# Altium schematic sheet FPGA_SUP_CFG.SchDoc: Phaser
size 420 x 297 mm; EDA_Number: ARTIQ; Projet: ARTIQ/SINARA; Author: G.Kasprowicz; CompanyName: WUT ISE; DrawnBy: G.Kasprowicz; Organization: WUT ISE; Address1: PW ISE; Address2: Nowowiejska 15/19 00-665 Warsaw; Address3: gkasprow@gmail.com; DocumentNumber: 12; Revision: 2; SheetNumber: 12; SheetTotal: 18; ModifiedBy: -; CheckedDate: -; Title2: FPGA SUP & caps + config; DivGrp: WUT ISE; Designer: G.Kasprowicz; ModifiedDate: -; ProjectName: Sensor Box
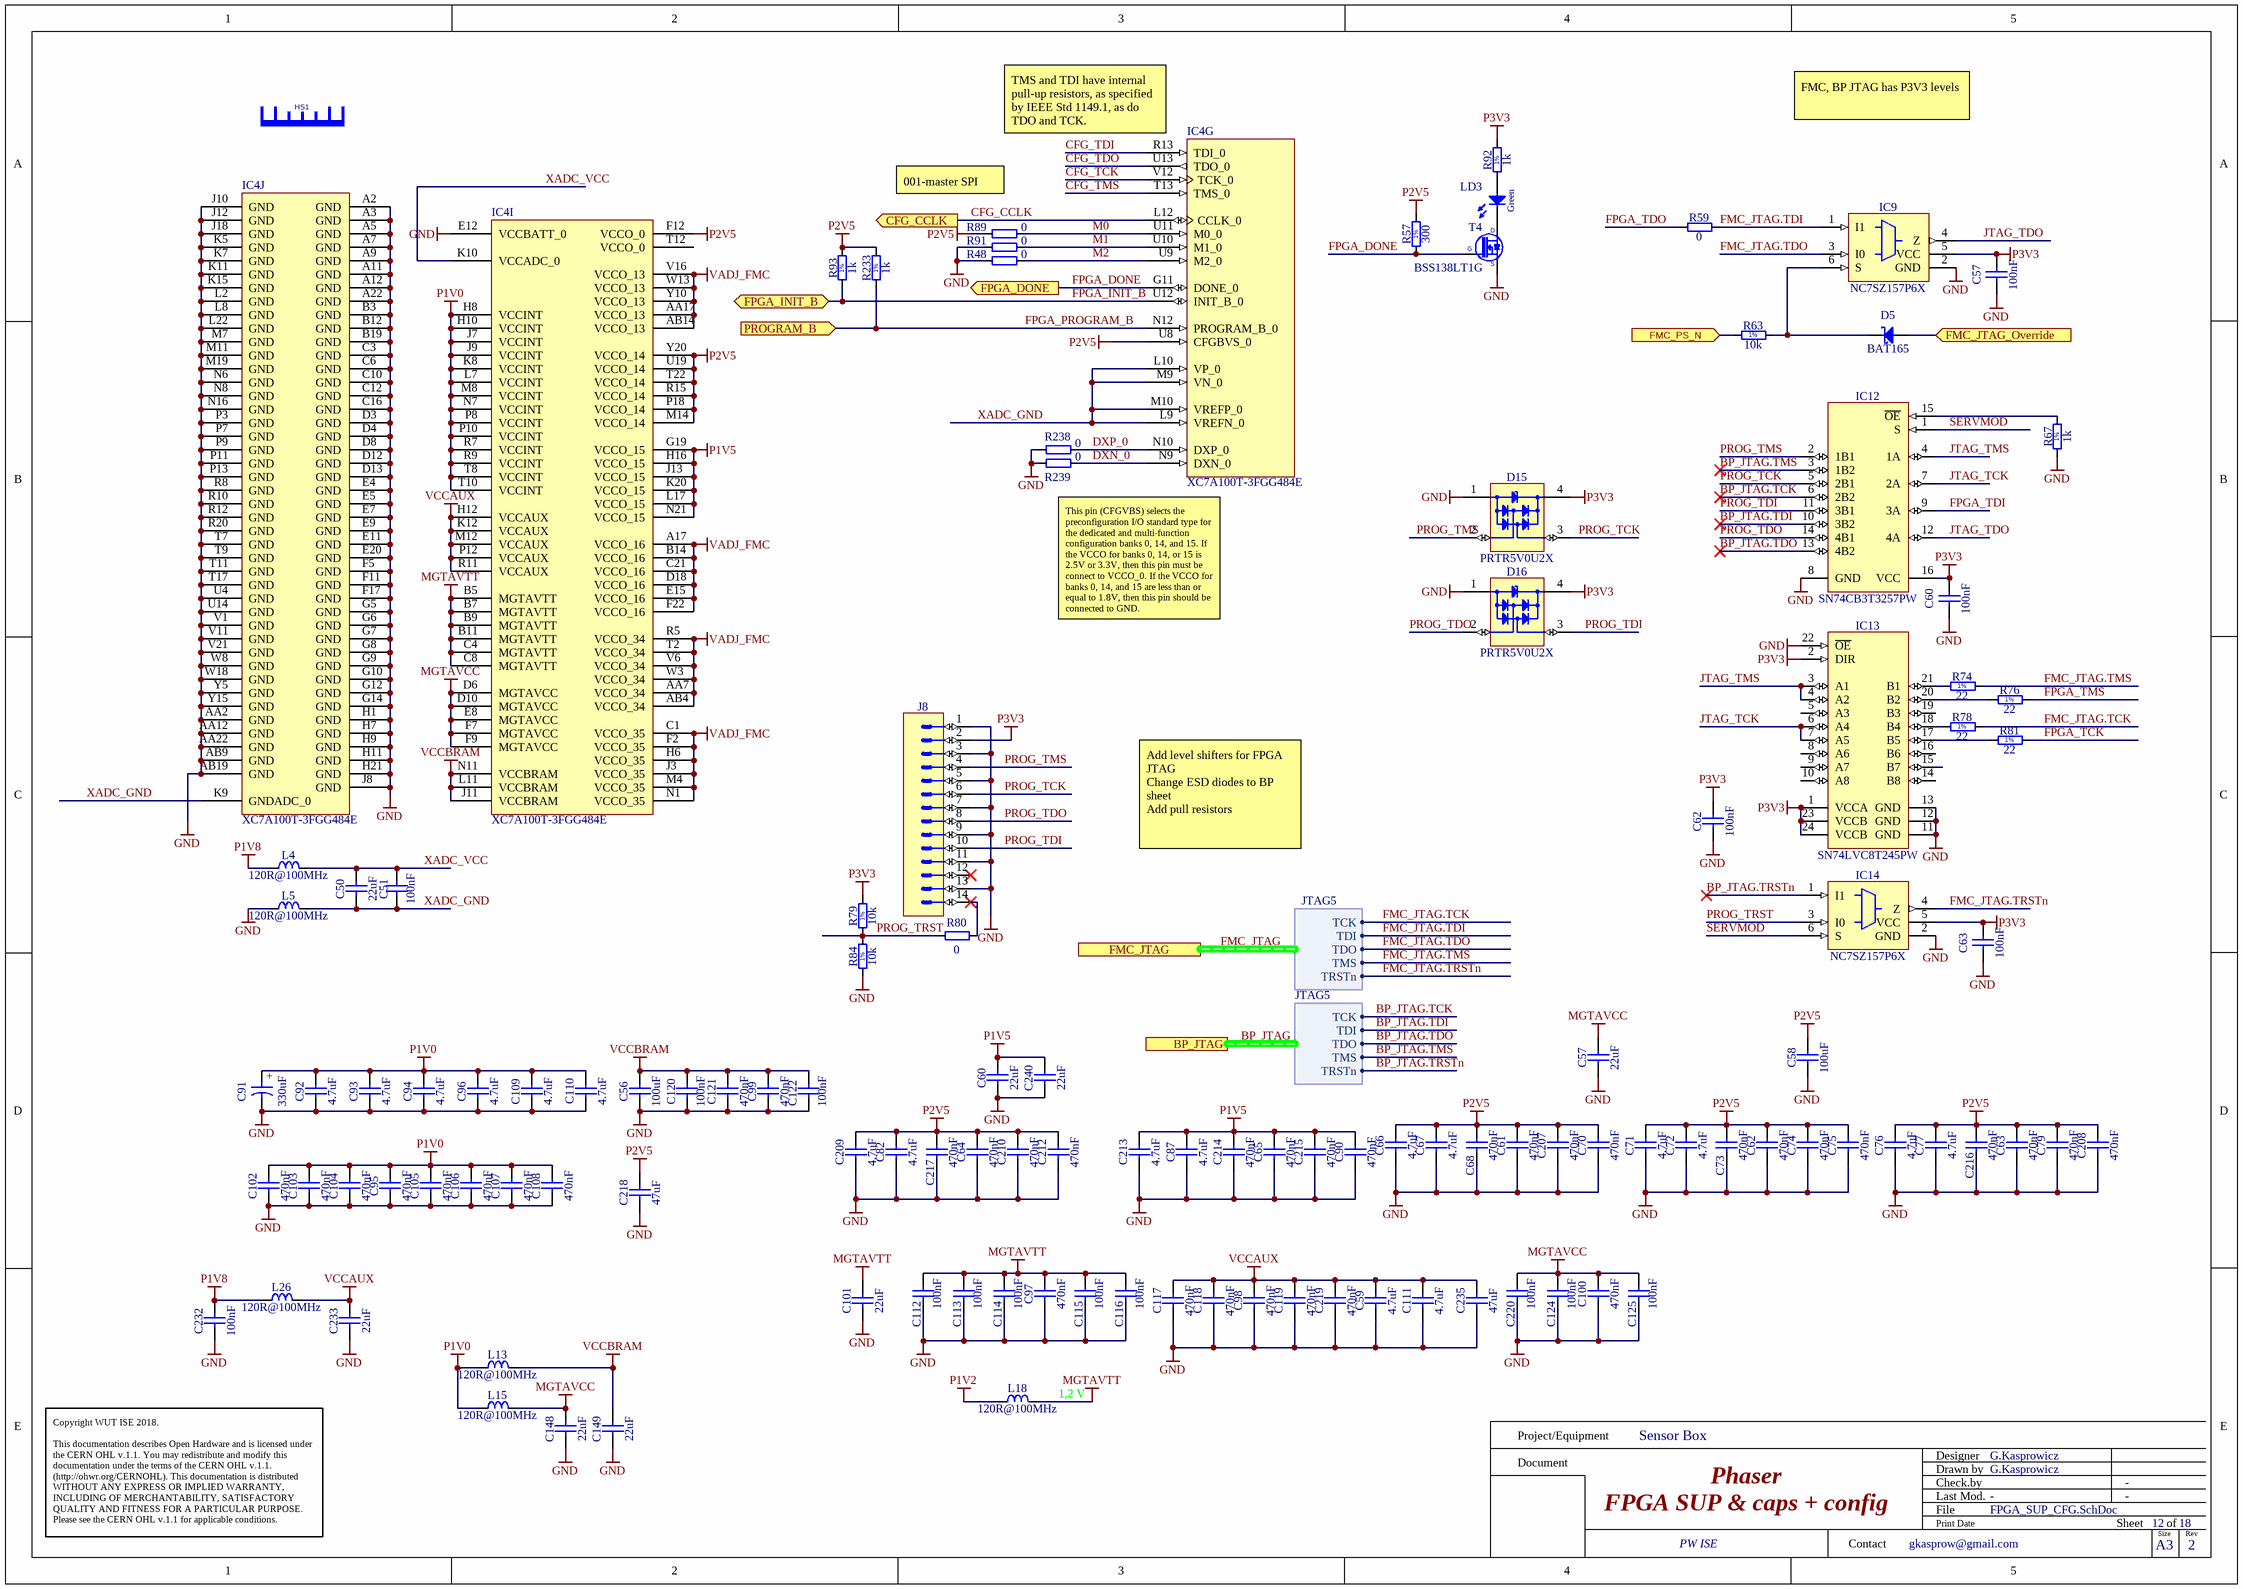
[diagram p0: FPGA_SUP_CFG.SchDoc]

## Parts
(Parts that share a designator on the sheet are numbered #1, #2 ... from top to bottom, then left to right.)
C50  22uF  [CAPC1709X100N]
C51  100nF  [CAPC0603X33N]
C56  100uF  [CAPC3225X270N]
C57#1  100nF  [CAPC1005X55N]
C57#2  22uF  [CAPC1709X100N]
C58  100uF  [CAPC3225X270N]
C59  4.7uF  [CAPC2012X135N]
C60#1  100nF  [CAPC1005X55N]
C60#2  22uF  [CAPC1709X100N]
C61  470nF  [CAPC0603X33N]
C62#1  100nF  [CAPC1005X55N]
C62#2  470nF  [CAPC0603X33N]
C63#1  100nF  [CAPC1005X55N]
C63#2  470nF  [CAPC0603X33N]
C64  470nF  [CAPC0603X33N]
C65  470nF  [CAPC0603X33N]
C66  4.7uF  [CAPC2012X135N]
C67  4.7uF  [CAPC2012X135N]
C68  470nF  [CAPC0603X33N]
C70  470nF  [CAPC0603X33N]
C71  4.7uF  [CAPC2012X135N]
C72  4.7uF  [CAPC2012X135N]
C73  470nF  [CAPC0603X33N]
C74  470nF  [CAPC0603X33N]
C75  470nF  [CAPC0603X33N]
C76  4.7uF  [CAPC2012X135N]
C77  4.7uF  [CAPC2012X135N]
C79  470nF  [CAPC0603X33N]
C82  4.7uF  [CAPC2012X135N]
C87  4.7uF  [CAPC2012X135N]
C90  470nF  [CAPC0603X33N]
C91  330uF  [CAPMP7343X190N]
C92  4.7uF  [CAPC2012X135N]
C93  4.7uF  [CAPC2012X135N]
C94  4.7uF  [CAPC2012X135N]
C95  470nF  [CAPC0603X33N]
C96  4.7uF  [CAPC2012X135N]
C97  470nF  [CAPC0603X33N]
C98  470nF  [CAPC0603X33N]
C99  470nF  [CAPC0603X33N]
C100  470nF  [CAPC0603X33N]
C101  22uF  [CAPC1709X100N]
C102  470nF  [CAPC0603X33N]
C103  470nF  [CAPC0603X33N]
C104  470nF  [CAPC0603X33N]
C105  470nF  [CAPC0603X33N]
C106  470nF  [CAPC0603X33N]
C107  470nF  [CAPC0603X33N]
C108  470nF  [CAPC0603X33N]
C109  4.7uF  [CAPC2012X135N]
C110  4.7uF  [CAPC2012X135N]
C111  4.7uF  [CAPC2012X135N]
C112  100nF  [CAPC0603X33N]
C113  100nF  [CAPC0603X33N]
C114  100nF  [CAPC0603X33N]
C115  100nF  [CAPC0603X33N]
C116  100nF  [CAPC0603X33N]
C117  470nF  [CAPC0603X33N]
C118  470nF  [CAPC0603X33N]
C119  470nF  [CAPC0603X33N]
C120  100nF  [CAPC0603X33N]
C121  470nF  [CAPC0603X33N]
C122  100nF  [CAPC0603X33N]
C124  100nF  [CAPC0603X33N]
C125  100nF  [CAPC0603X33N]
C148  22uF  [CAPC1709X100N]
C149  22uF  [CAPC1709X100N]
C207  470nF  [CAPC0603X33N]
C208  470nF  [CAPC0603X33N]
C209  4.7uF  [CAPC2012X135N]
C210  470nF  [CAPC0603X33N]
C212  470nF  [CAPC0603X33N]
C213  4.7uF  [CAPC2012X135N]
C214  470nF  [CAPC0603X33N]
C215  470nF  [CAPC0603X33N]
C216  470nF  [CAPC0603X33N]
C217  470nF  [CAPC0603X33N]
C218  47uF  [CAPC3225X270N]
C219  470nF  [CAPC0603X33N]
C220  100nF  [CAPC0603X33N]
C232  100nF  [CAPC0603X33N]
C233  22uF  [CAPC1709X100N]
C235  47uF  [CAPC3225X270N]
C240  22uF  [CAPC1709X100N]
D5  BAT165  [SOD2512X110N]
D15  PRTR5V0U2X  [SOT190P230X110-4N]
D16  PRTR5V0U2X  [SOT190P230X110-4N]
HS1  RADIAN_FI23  [RADIAN_FI23]  (value not drawn)
IC4  XC7A100T-3FGG484E  [FGG484]  (parts G,I,J of 10)
IC9  NC7SZ157P6X  [SOT65P210X110-6N]
IC12  SN74CB3T3257PW  [SOP65P640X120-16N]
IC13  SN74LVC8T245PW  [SOP65P640X120-24N]
IC14  NC7SZ157P6X  [SOT65P210X110-6N]
J8  Milli-Grid™  [MOLEX_87832-1420]  (value not drawn)
L4  120R@100MHz  [INDC1608X65N]
L5  120R@100MHz  [INDC1608X65N]
L13  120R@100MHz  [INDC1608X65N]
L15  120R@100MHz  [INDC1608X65N]
L18  120R@100MHz  [INDC1608X65N]
L26  120R@100MHz  [INDC1608X65N]
LD3  Green  [LED_KINGBRIGHT_KPH-1608CGCK]
R48  0  [RESC1005X40N]
R57  300  [RESC1005X40N]
R59  0  [RESC1005X40N]
R63  10k  [RESC1005X40N]
R67  1k  [RESC1005X40N]
R74  22  [RESC1005X40N]
R76  22  [RESC1005X40N]
R78  22  [RESC1005X40N]
R79  10k  [RESC1005X40N]
R80  0  [RESC1005X40N]
R81  22  [RESC1005X40N]
R84  10k  [RESC1005X40N]
R89  0  [RESC1005X40N]
R91  0  [RESC1005X40N]
R92  1k  [RESC1005X40N]
R93  1k  [RESC1005X40N]
R233  1k  [RESC1005X40N]
R238  0  [RESC1005X40N]
R239  0  [RESC1005X40N]
T4  BSS138LT1G  [SOT95P240X110-3N]

## Ports
BP_JTAG (harness JTAG5), CFG_CCLK (out), FMC_JTAG (harness JTAG5), FMC_JTAG_Override (in), FMC_PS_N (in), FPGA_DONE (out), FPGA_INIT_B (bidir), PROGRAM_B (in)

## Harnesses
JTAG5: TCK, TDI, TDO, TMS, TRSTn

## Nets
GND: C56.1 C57#1.1 C57#2.1 C58.1 C59.1 C60#1.1 C60#2.1 C61.1 C62#1.1 C62#2.1 C63#1.1 C63#2.1 C64.1 C65.1 C66.1 C67.1 C68.1 C70.1 C71.1 C72.1 C73.1 C74.1 C75.1 C76.1 C77.1 C79.1 C82.1 C87.1 C90.1 C91.2 C92.1 C93.1 C94.1 C95.1 C96.1 C97.1 C98.1 C99.1 C100.1 C101.1 C102.1 C103.1 C104.1 C105.1 C106.1 C107.1 C108.1 C109.1 C110.1 C111.1 C112.1 C113.1 C114.1 C115.1 C116.1 C117.1 C118.1 C119.1 C120.1 C121.1 C122.1 C124.1 C125.1 C148.1 C149.1 C207.1 C208.1 C209.1 C210.1 C212.1 C213.1 C214.1 C215.1 C216.1 C217.1 C218.1 C219.1 C220.1 C232.1 C233.1 C235.1 C240.1 D15.1(GND) D16.1(GND) IC4.A2(GND) IC4.A3(GND) IC4.A5(GND) IC4.A7(GND) IC4.A9(GND) IC4.A11(GND) IC4.A12(GND) IC4.A22(GND) IC4.AA2(GND) IC4.AA12(GND) IC4.AA22(GND) IC4.AB9(GND) IC4.AB19(GND) IC4.B3(GND) IC4.B12(GND) IC4.B19(GND) IC4.C3(GND) IC4.C6(GND) IC4.C10(GND) IC4.C12(GND) IC4.C16(GND) IC4.D3(GND) IC4.D4(GND) IC4.D8(GND) IC4.D12(GND) IC4.D13(GND) IC4.E4(GND) IC4.E5(GND) IC4.E7(GND) IC4.E9(GND) IC4.E11(GND) IC4.E12(VCCBATT_0) IC4.E20(GND) IC4.F5(GND) IC4.F11(GND) IC4.F17(GND) IC4.G5(GND) IC4.G6(GND) IC4.G7(GND) IC4.G8(GND) IC4.G9(GND) IC4.G10(GND) IC4.G12(GND) IC4.G14(GND) IC4.H1(GND) IC4.H7(GND) IC4.H9(GND) IC4.H11(GND) IC4.H21(GND) IC4.J8(GND) IC4.J10(GND) IC4.J12(GND) IC4.J18(GND) IC4.K5(GND) IC4.K7(GND) IC4.K11(GND) IC4.K15(GND) IC4.L2(GND) IC4.L8(GND) IC4.L22(GND) IC4.M7(GND) IC4.M11(GND) IC4.M19(GND) IC4.N6(GND) IC4.N8(GND) IC4.N16(GND) IC4.P3(GND) IC4.P7(GND) IC4.P9(GND) IC4.P11(GND) IC4.P13(GND) IC4.R8(GND) IC4.R10(GND) IC4.R12(GND) IC4.R20(GND) IC4.T7(GND) IC4.T9(GND) IC4.T11(GND) IC4.T17(GND) IC4.U4(GND) IC4.U14(GND) IC4.V1(GND) IC4.V11(GND) IC4.V21(GND) IC4.W8(GND) IC4.W18(GND) IC4.Y5(GND) IC4.Y15(GND) IC9.2(GND) IC12.8(GND) IC13.11(GND) IC13.12(GND) IC13.13(GND) IC13.22(~{OE}) IC14.2(GND) J8.1 J8.3 J8.5 J8.7 J8.9 J8.11 J8.13 L5.1 R48.1 R67.1 R84.1 R91.1 R238.1 R239.1 T4.2(S)
MGTAVCC: C57#2.2 C100.2 C124.2 C125.2 C148.2 C220.2 IC4.D6(MGTAVCC) IC4.D10(MGTAVCC) IC4.E8(MGTAVCC) IC4.F7(MGTAVCC) IC4.F9(MGTAVCC) L15.2
MGTAVTT: C97.2 C101.2 C112.2 C113.2 C114.2 C115.2 C116.2 IC4.B5(MGTAVTT) IC4.B7(MGTAVTT) IC4.B9(MGTAVTT) IC4.B11(MGTAVTT) IC4.C4(MGTAVTT) IC4.C8(MGTAVTT) L18.2
P1V0: C91.1 C92.2 C93.2 C94.2 C95.2 C96.2 C102.2 C103.2 C104.2 C105.2 C106.2 C107.2 C108.2 C109.2 C110.2 IC4.H8(VCCINT) IC4.H10(VCCINT) IC4.J7(VCCINT) IC4.J9(VCCINT) IC4.K8(VCCINT) IC4.L7(VCCINT) IC4.M8(VCCINT) IC4.N7(VCCINT) IC4.P8(VCCINT) IC4.P10(VCCINT) IC4.R7(VCCINT) IC4.R9(VCCINT) IC4.T8(VCCINT) IC4.T10(VCCINT) L13.1 L15.1
P1V2: L18.1
P1V5: C60#2.2 C65.2 C87.2 C90.2 C213.2 C214.2 C215.2 C240.2 IC4.G19(VCCO_15) IC4.H16(VCCO_15) IC4.J13(VCCO_15) IC4.K20(VCCO_15) IC4.L17(VCCO_15) IC4.N21(VCCO_15)
P1V8: C232.2 L4.1 L26.1
P2V5: C58.2 C61.2 C62#2.2 C63#2.2 C64.2 C66.2 C67.2 C68.2 C70.2 C71.2 C72.2 C73.2 C74.2 C75.2 C76.2 C77.2 C79.2 C82.2 C207.2 C208.2 C209.2 C210.2 C212.2 C216.2 C217.2 C218.2 IC4.F12(VCCO_0) IC4.M14(VCCO_14) IC4.P18(VCCO_14) IC4.R15(VCCO_14) IC4.T22(VCCO_14) IC4.U8(CFGBVS_0) IC4.U19(VCCO_14) IC4.Y20(VCCO_14) R57.2 R89.1 R93.2 R233.2
P3V3: C57#1.2 C60#1.2 C62#1.2 C63#1.2 D15.4(VCC) D16.4(VCC) IC9.5(VCC) IC12.16(VCC) IC13.1(VCCA) IC13.2(DIR) IC13.23(VCCB) IC13.24(VCCB) IC14.5(VCC) J8.2 R79.2 R92.2
VADJ_FMC: IC4.A17(VCCO_16) IC4.AA7(VCCO_34) IC4.AA17(VCCO_13) IC4.AB4(VCCO_34) IC4.AB14(VCCO_13) IC4.B14(VCCO_16) IC4.C1(VCCO_35) IC4.C21(VCCO_16) IC4.D18(VCCO_16) IC4.E15(VCCO_16) IC4.F2(VCCO_35) IC4.F22(VCCO_16) IC4.H6(VCCO_35) IC4.J3(VCCO_35) IC4.M4(VCCO_35) IC4.N1(VCCO_35) IC4.R5(VCCO_34) IC4.T2(VCCO_34) IC4.V6(VCCO_34) IC4.V16(VCCO_13) IC4.W3(VCCO_34) IC4.W13(VCCO_13) IC4.Y10(VCCO_13)
VCCAUX: C59.2 C98.2 C111.2 C117.2 C118.2 C119.2 C219.2 C233.2 C235.2 IC4.H12(VCCAUX) IC4.K12(VCCAUX) IC4.M12(VCCAUX) IC4.P12(VCCAUX) IC4.R11(VCCAUX) L26.2
VCCBRAM: C56.2 C99.2 C120.2 C121.2 C122.2 C149.2 IC4.J11(VCCBRAM) IC4.L11(VCCBRAM) IC4.N11(VCCBRAM) L13.2
BP_JTAG.TCK: IC12.6(2B2) ; port BP_JTAG.TCK
BP_JTAG.TDI: IC12.10(3B2) ; port BP_JTAG.TDI
BP_JTAG.TDO: IC12.13(4B2) ; port BP_JTAG.TDO
BP_JTAG.TMS: IC12.3(1B2) ; port BP_JTAG.TMS
BP_JTAG.TRSTn: IC14.1(I1) ; port BP_JTAG.TRSTn
CFG_CCLK: IC4.L12(CCLK_0) ; port CFG_CCLK
CFG_TCK: IC4.V12(TCK_0)
CFG_TDI: IC4.R13(TDI_0)
CFG_TDO: IC4.U13(TDO_0)
CFG_TMS: IC4.T13(TMS_0)
DXN_0: IC4.N9(DXN_0) R239.2
DXP_0: IC4.N10(DXP_0) R238.2
FMC_JTAG.TCK: R78.2 ; port FMC_JTAG.TCK
FMC_JTAG.TDI: IC9.1(I1) R59.2 ; port FMC_JTAG.TDI
FMC_JTAG.TDO: IC9.3(I0) ; port FMC_JTAG.TDO
FMC_JTAG.TMS: R74.2 ; port FMC_JTAG.TMS
FMC_JTAG.TRSTn: IC14.4(Z) ; port FMC_JTAG.TRSTn
FMC_JTAG_Override: D5.2(A) ; port FMC_JTAG_Override
FMC_PS_N: R63.2 ; port FMC_PS_N
FPGA_DONE: IC4.G11(DONE_0) R57.1 T4.1(G) ; port FPGA_DONE
FPGA_INIT_B: IC4.U12(INIT_B_0) R93.1 ; port FPGA_INIT_B
FPGA_PROGRAM_B: IC4.N12(PROGRAM_B_0) R233.1 ; port PROGRAM_B
FPGA_TCK: R81.2
FPGA_TDI: IC12.9(3A)
FPGA_TDO: R59.1
FPGA_TMS: R76.2
JTAG_TCK: IC12.7(2A) IC13.6(A4) IC13.7(A5)
JTAG_TDO: IC9.4(Z) IC12.12(4A)
JTAG_TMS: IC12.4(1A) IC13.3(A1) IC13.4(A2)
M0: IC4.U11(M0_0) R89.2
M1: IC4.U10(M1_0) R91.2
M2: IC4.U9(M2_0) R48.2
PROG_TCK: D15.3(I/O2) IC12.5(2B1) J8.6
PROG_TDI: D16.3(I/O2) IC12.11(3B1) J8.10
PROG_TDO: D16.2(I/O1) IC12.14(4B1) J8.8
PROG_TMS: D15.2(I/O1) IC12.2(1B1) J8.4
PROG_TRST: IC14.3(I0) R79.1 R80.2 R84.2
SERVMOD: IC12.1(S) IC14.6(S)
XADC_GND: C50.1 C51.1 IC4.K9(GNDADC_0) IC4.L9(VREFN_0) IC4.L10(VP_0) IC4.M9(VN_0) IC4.M10(VREFP_0) L5.2
XADC_VCC: C50.2 C51.2 IC4.K10(VCCADC_0) L4.2
NetD5_1: D5.1(C) IC9.6(S) R63.1
NetIC12_15: IC12.15(~{OE}) R67.2
NetIC13_17: IC13.17(B5) R81.1
NetIC13_18: IC13.18(B4) R78.1
NetIC13_20: IC13.20(B2) R76.1
NetIC13_21: IC13.21(B1) R74.1
NetJ8_14: J8.14 R80.1
NetLD3_1: LD3.1(C) T4.3(D)
NetLD3_2: LD3.2(A) R92.1

Not connected (* = marked no-connect by the designer): IC4 T12(VCCO_0); IC13 5(A3) 8(A6) 9(A7) 10(A8) 14(B8) 15(B7) 16(B6) 19(B3); J8 12*

## Buses and harness runs
harness BP_JTAG = port BP_JTAG
harness FMC_JTAG = port FMC_JTAG

## Notes on the sheet
- (near IC4) TMS and TDI have internal pull-up resistors, as specified by IEEE Std 1149.1, as do TDO and TCK.
- FMC, BP JTAG has P3V3 levels
- 001-master SPI
- This pin (CFGVBS) selects the preconfiguration I/O standard type for the dedicated and multi-function configuration banks 0, 14, and 15. If the VCCO for banks 0, 14, or 15 is 2.5V or 3.3V, then this pin must be connect to VCCO_0. If the VCCO for banks 0, 14, and 15 are less than or equal to 1.8V, then this pin should be connected to GND.
- Add level shifters for FPGA JTAG
  Change ESD diodes to BP sheet
  Add pull resistors
- (near L18) 1,2 V
- Project/Equipment
- Document
- Designer
- Drawn by
- Check.by
- Copyright WUT ISE 2018.
  This documentation describes Open Hardware and is licensed under the CERN OHL v.1.1. You may redistribute and modify this documentation under the terms of the CERN OHL v.1.1. (http://ohwr.org/CERNOHL). This documentation is distributed WITHOUT ANY EXPRESS OR IMPLIED WARRANTY, INCLUDING OF MERCHANTABILITY, SATISFACTORY QUALITY AND FITNESS FOR A PARTICULAR PURPOSE. Please see the CERN OHL v.1.1 for applicable conditions.
- Contact
- File
- Last Mod.
- Print Date
- Sheet
- Size
- A3
- of
- Rev
- (in symbol CTE7343-19_330UF_2.5V_20%_LESR0025_KEMET_T520) +
- (in symbol R0402_1K_1%_0.0625W_100PPM) 1%
- (in symbol R0402_1k_1%_0.0625W_100PPM) 1%
- (in symbol R0402_10K_1%_0.0625W_100PPM) 1%
- (in symbol R0402_22R_1%_0.0625W_100PPM) 1%
- (in symbol R0402_300R_1%_0.0625W_100PPM) 1%

## Library data of the parts
C50 C57#2 C60#2 C101 C148 C149 C233 C240 = CC0603_22UF_6.3V_20%_X5R: Non-polarised capacitor; Part Description: SMD Multilayer Chip Ceramic Capacitor; Manufacturer: GENERIC; Manufacturer1 Part Number: C1608X5R0J226M080AC; Voltage: 6.3V; TC: X5R; Tolerance: ±20%; Part Number: CC0603_22UF_6.3V_20%_X5R; Component Kind: Standard; Component Type: Standard; Pin Count: 2; Value: 22uF; Status: None; Manufacturer Part Number: CC0603_22UF_6.3V_20%_X5R; Case: 0603; Mounted: Yes; Socket: No; SMD: Yes; Sense: No; Manufacturer1 Example: TDK; Manufacturer1 ComponentHeight: 1mm; HelpURL: \\cern.ch\dfs\Applications\Altium\Datasheets\CC0603_X5R_TDK_C.pdf; Author: CERN DEM JLC; CreateDate: 16.12.2013; LatestRevisionDate: 13.09.2016
  C50 C57#2 C60#2 C101 C240: ClassName: Artix
C51 C112-C116 C120 C122 C124 C125 C220 C232 = CC0201_100NF_6.3V_10%_X5R: Non-polarised capacitor; Part Description: SMD Multilayer Chip Ceramic Capacitor; Manufacturer: GENERIC; Manufacturer1 Part Number: 02016D104KAT2A; Voltage: 6.3V; TC: X5R; Tolerance: ±10%; Part Number: CC0201_100NF_6.3V_10%_X5R; Component Kind: Standard; Component Type: Standard; Pin Count: 2; Value: 100nF; Status: Not Recommended; Manufacturer Part Number: CC0201_100NF_6.3V_10%_X5R; Case: 0201; Mounted: Yes; Socket: No; SMD: Yes; Sense: No; Manufacturer1 Example: AVX; Manufacturer1 ComponentHeight: 0.33mm; HelpURL: \\cern.ch\dfs\Applications\Altium\Datasheets\CC0201_X5R_AVX.pdf; Author: CERN DEM JLC
  C51 C112-C116 C120 C122 C124 C125 C220: CreateDate: 2007-12-03; LatestRevisionDate: 2007-12-03; ClassName: Artix
  C232: CreateDate: 03.12.2007; LatestRevisionDate: 03.12.2007
C56 C58 = CC1210_100UF_6.3V_20%_X5R: Non-polarised capacitor; Part Description: SMD Multilayer Chip Ceramic Capacitor; Manufacturer: GENERIC; Manufacturer1 Part Number: GRM32ER60J107ME20L; Voltage: 6.3V; TC: X5R; Tolerance: ±20%; Part Number: CC1210_100UF_6.3V_20%_X5R; Component Kind: Standard; Component Type: Standard; Pin Count: 2; Value: 100uF; Status: Preferred; Manufacturer Part Number: CC1210_100UF_6.3V_20%_X5R; Case: 1210; Mounted: Yes; Socket: No; SMD: Yes; Sense: No; Manufacturer1 Example: MURATA; Manufacturer1 ComponentHeight: 2.7mm; HelpURL: \\cern.ch\dfs\Applications\Altium\Datasheets\CC1210_X5R_MURATA.pdf; Author: CERN DEM JLC; CreateDate: 19.04.2010; LatestRevisionDate: 19.04.2010
C57#1 C60#1 C62#1 C63#1 = CC0402_100NF_25V_10%_X7R_YUDEN_TMK105B7104KVHF: Non-polarised capacitor; Part Description: SMD Multilayer Chip Ceramic Capacitor (High Dielectric Type) for Automotive / Industrial Applications; Manufacturer: TAIYO YUDEN; Voltage: 25V; TC: X7R; Tolerance: ±10%; Part Number: CC0402_100NF_25V_10%_X7R_YUDEN_TMK105B7104KVHF; Component Kind: Standard; Component Type: Standard; Pin Count: 2; Value: 100nF; Status: Not Recommended; Manufacturer Part Number: TMK105B7104KVHF; Case: 0402; Mounted: Yes; Socket: No; SMD: Yes; Sense: No; HelpURL: \\cern.ch\dfs\Applications\Altium\Datasheets\CC0402_TAIYO-YUDEN_TMK105B7104KVHF.pdf; Author: CERN DEM JLC; CreateDate: 10-May-17; LatestRevisionDate: 10-May-17; ComponentHeight: 0.55mm
C59 C66 C67 C71 C72 C76 C77 C82 C87 C92-C94 C96 C109-C111 C209 C213 = CC0805_4.7UF_10V_10%_X5R: Non-polarised capacitor; Manufacturer: GENERIC; Part Description: SMD Multilayer Chip Ceramic Capacitor; Manufacturer1 Part Number: 222224013672; Voltage: 10V; TC: X5R; Tolerance: ±10%; Part Number: CC0805_4.7UF_10V_10%_X5R; Component Kind: Standard; Component Type: Standard; Pin Count: 2; Value: 4.7uF; Status: Preferred; Manufacturer Part Number: CC0805_4.7UF_10V_10%_X5R; Case: 0805; Mounted: Yes; Socket: No; SMD: Yes; Sense: No; Manufacturer1 Example: PHYCOMP; Manufacturer1 ComponentHeight: 1.45mm; HelpURL: \\cern.ch\dfs\Applications\Altium\Datasheets\CC0805_X5R_PHYCOMP_HC.pdf; Author: CERN DEM JLC; CreateDate: 03.12.2007; LatestRevisionDate: 03.12.2007
C61 C62#2 C63#2 C64 C65 C68 C70 C73-C75 C79 C90 C95 C97-C100 C102-C108 C117-C119 C121 C207 C208 C210 C212 C214-C217 C219 = CC0201_470NF_4V_20%_X5R: Non-polarised capacitor; Part Description: SMD Multilayer Chip Ceramic Capacitor; Manufacturer: GENERIC; Manufacturer1 Part Number: AMK063BJ474MP-F; Voltage: 4V; TC: X5R; Tolerance: ±20%; Part Number: CC0201_470NF_4V_20%_X5R; Component Kind: Standard; Component Type: Standard; Pin Count: 2; Value: 470nF; Status: Not Recommended; Manufacturer Part Number: CC0201_470NF_4V_20%_X5R; Case: 0201; Mounted: Yes; Socket: No; SMD: Yes; Sense: No; Manufacturer1 Example: TAIYO YUDEN; Manufacturer1 ComponentHeight: 0.33mm; HelpURL: \\cern.ch\dfs\Applications\Altium\Datasheets\CC0201_X5R_TAIYO-YUDEN_STANDARD-CLASS2.pdf; Author: CERN DEM JLC; CreateDate: 27.05.2010; LatestRevisionDate: 27.05.2010
  C61 C62#2 C63#2 C64 C65 C95 C97-C100: ClassName: Artix
C91 = CTE7343-19_330UF_2.5V_20%_LESR0025_KEMET_T520: Polarised capacitor; Part Description: Low ESR 0R025 Tantalum Chip Capacitor; Manufacturer: KEMET; Manufacturer Part Number: T520V337M2R5ATE025; Voltage: 2.5V; Tolerance: ±20%; Part Number: CTE7343-19_330UF_2.5V_20%_LESR0025_KEMET_T520; Component Kind: Standard; Component Type: Standard; Pin Count: 2; Value: 330uF; Status: None; Case: V; Mounted: Yes; Socket: No; SMD: Yes; Sense: No; ComponentHeight: 1.9mm; HelpURL: \\cern.ch\dfs\Applications\Altium\Datasheets\CTE-LESR_KEMET_T520.pdf; Author: CERN DEM MR; CreateDate: 23.03.2016; LatestRevisionDate: 23.03.2016
C218 C235 = CC1210_47UF_10V_10%_X7R: Non-polarised capacitor; Part Description: SMD Multilayer Chip Ceramic Capacitor; Manufacturer: GENERIC; Manufacturer1 Part Number: GRM32ER71A476KE15; Voltage: 10V; TC: X7R; Tolerance: ±10%; Part Number: CC1210_47UF_10V_10%_X7R; Component Kind: Standard; Component Type: Standard; Pin Count: 2; Value: 47uF; Status: None; Manufacturer Part Number: CC1210_47UF_10V_10%_X7R; Case: 1210; Mounted: Yes; Socket: No; SMD: Yes; Sense: No; Manufacturer1 Example: MURATA; Manufacturer1 ComponentHeight: 2.7mm; HelpURL: \\cern.ch\dfs\Applications\Altium\Datasheets\CC1210_X7R_MURATA.pdf; Author: CERN DEM BC; CreateDate: 18.11.2015; LatestRevisionDate: 18.11.2015
D5 = BAT165: Schottky Diode; Manufacturer: INFINEON; Part Description: Medium Power AF Schottky Diode; Voltage: 40V; Power: 750mA; PressFit: No; Bonding: No; Manufacturer Part Number: BAT165; PackageDescription: Small Outline Diode (SOD-323), 1.70mm W X 1.25mm L X 1.10mm H body,  IPC Medium Density; Part Number: BAT165; Component Kind: Standard; Component Type: Standard; Device: BAT165; Pin Count: 2; Case: SOD323; Mounted: Yes; Socket: No; SMD: Yes; Sense: No; ComponentHeight: 1.1mm; HelpURL: \\cern.ch\dfs\Applications\Altium\Datasheets\BAT165.pdf; Author: CERN DEM JLC; CreateDate: 12.11.2014; LatestRevisionDate: 12.11.2014
D15 D16 = PRTR5V0U2X: Ultra Low Capacitance Double Rail-to-Rail ESD Protection Diode; Part Description: Ultra Low Capacitance (1pF) Double Rail-to-Rail ESD Protection Diode (8kV); Manufacturer: NXP SEMICONDUCTORS; Voltage: 5.5V; PressFit: No; Bonding: No; Part Number: PRTR5V0U2X; Component Kind: Standard; Component Type: Standard; Device: PRTR5V0U2X; PackageDescription: SOT143B, SOT, 1.90mm Pitch; 4 Pin, 1.30mm W X 2.90mm L X 1.10mm H body, IPC Medium Density; Manufacturer Part Number: PRTR5V0U2X; Pin Count: 4; Case: SOT143B; Mounted: Yes; Socket: No; SMD: Yes; Sense: No; ComponentHeight: 1.1mm; HelpURL: \\cern.ch\dfs\Applications\Altium\Datasheets\PRTR5V0U2X.pdf; Author: CERN DEM JLC; CreateDate: 22.03.2011; LatestRevisionDate: 22.03.2011
HS1 = RADIAN_FI23: Heat Sink Without Pad; Manufacturer: Radian Thermal Products, Inc.; Manufacturer Part Number: FI23+BU+T725; Part Description: 23 x 23 x 16 mm, clip on heatsink with fan for IC design BGA and others; ComponentHeight: 16 mm; HelpURL: https://www.radianheatsinks.com/product/fi23/
IC4 = CMP-0364-00028-3: Artix-7 FPGA, 285 User I/Os, 4 GTP, 484-Ball BGA, Speed Grade 3, Extended Grade, Pb-Free; Manufacturer: Xilinx; Max User I/O: 300; Clock Mgmt Tiles (CMTs): 6; Logic Cells: 101440; Block RAM Blocks (36Kb): 135; Block RAM Blocks (18Kb): 270; Speed Grade: -3; CLBs (Slices): 15850; Block RAM Blocks (Max Kb): 4860; DSP48E1 Slices: 240; RoHS: Pb-Free; ComponentLink3URL: http://www.xilinx.com/support/documentation/data_sheets/ds181_Artix_7_Data_Sheet.pdf; NexusDeviceID: XC7A100T-3FGG484E; DatasheetVersion: v1.12; Mounting Technology: Surface Mount; PackageDescription: Wire-Bond Fine-Pitch BGA, Body 23 x 23 mm, 1.0 mm Pitch; PackageReference: FGG484; ComponentLink2Description: Package Specification; Code_JEDEC: MS-034-AAJ-1; ComponentLink2URL: http://www.xilinx.com/support/documentation/user_guides/ug475_7Series_Pkg_Pinout.pdf; ComponentLink3Description: DC and Switching Characteristics; Generic Part Number: XC7A100T; ComponentLink4Description: Package File; ComponentLink4URL: http://www.xilinx.com/support/packagefiles/a7packages/xc7a100tfgg484pkg.txt; ComponentLink1URL: http://www.xilinx.com/support/documentation/data_sheets/ds180_7Series_Overview.pdf; PartNumber: XC7A100T-3FGG484E; ComponentLink5URL: http://www.xilinx.com/support/documentation/user_guides/ug475_7Series_Pkg_Pinout.pdf; PackageVersion: Rev 1.8; ComponentLink5Description: Packaging and Pinout; ComponentLink1Description: Datasheet; CLBs (Max Distributed RAM Kb): 1188
IC9 IC14 = NC7SZ157P6X: TinyLogic® UHS 2-Input Non-Inverting Multiplexer; Manufacturer: FAIRCHILD SEMICONDUCTOR; PressFit: No; Bonding: No; Manufacturer Part Number: NC7SZ157P6X; PackageDescription: SOT363, 0.65mm pitch; 6 pin, 1.40mm W X 2.15mm L, IPC Medium Density; Part Description: TinyLogic® UHS 2-Input Non-Inverting Multiplexer; Part Number: NC7SZ157P6X; Component Kind: Standard; Component Type: Standard; Device: NC7SZ157P6X; Pin Count: 6; Case: SOT363; Mounted: Yes; Socket: No; SMD: Yes; Sense: No; ComponentHeight: 1.1mm; Author: CERN DEM JLC; HelpURL: \\cern.ch\dfs\Applications\Altium\Datasheets\NC7SZ157P6X.pdf; CreateDate: 22.03.2012; LatestRevisionDate: 22.03.2012
IC12 = SN74CB3T3257PW: 4-BIT 1-OF-2 FET Multiplexer/Demultiplexer 2.5V/3.3V Low-Voltage Bus Switch 5V Tolerant Shifter; Manufacturer: TEXAS INSTRUMENTS; PressFit: No; Bonding: No; Part Number: SN74CB3T3257PW; Component Kind: Standard; Component Type: Standard; Device: SN74CB3T3257PW; PackageDescription: SOP, 0.65mm Pitch; 16 Pin, 4.40mm W X 5.00mm L X 1.20mm H body, IPC Medium Density; Part Description: 4-Bit 1-of-2 FET Multiplexer/Demultiplexer 2.5V/3.3V Low-Voltage Bus Switch 5V Tolerant Shifter; Manufacturer Part Number: SN74CB3T3257PW; Pin Count: 16; Case: TSSOP16; Mounted: Yes; Socket: No; SMD: Yes; Sense: No; ComponentHeight: 1.2mm; Author: CERN DEM JLC; HelpURL: \\cern.ch\dfs\Applications\Altium\Datasheets\SN74CB3T3257PW.pdf; CreateDate: 2012-01-30; LatestRevisionDate: 2012-01-30
IC13 = SN74LVC8T245PW: 8-Bit Dual-Supply Bus Transceiver With Configurable Voltage Translation and 3-State Outputs; Manufacturer: TEXAS INSTRUMENTS; PressFit: No; Bonding: No; Part Number: SN74LVC8T245PW; Component Kind: Standard; Component Type: Standard; Device: SN74LVC8T245PW; PackageDescription: SOP, 0.65mm Pitch; 24 Pin, 4.40mm W X 7.80mm L X 1.20mm H Body, IPC Medium Density; Part Description: 8-Bit Dual-Supply Bus Transceiver With Configurable Voltage Translation and 3-State Outputs; Manufacturer Part Number: SN74LVC8T245PW; Pin Count: 24; Case: TSSOP24; Mounted: Yes; Socket: No; SMD: Yes; Sense: No; ComponentHeight: 1.2mm; Author: CERN DEM JLC; HelpURL: \\cern.ch\dfs\Applications\Altium\Datasheets\SN74LVC8T245PW.pdf; CreateDate: 02.09.2009; LatestRevisionDate: 02.09.2009
J8 = MOLEX_87832-1420: Connector 14 Male; Part Description: 2.00mm (.079") Pitch Milli-Grid™ Header, Surface Mount, Vertical, Shrouded, 14 Circuits,with Locking Windows and Centre Polarization Slot, PCB Locator; Manufacturer: MOLEX; PressFit: No; Part Number: MOLEX_87832-1420; Component Kind: Standard; Component Type: Standard; Pin Count: 14; Family: Milli-Grid™; Mounted: Yes; Socket: No; SMD: Yes; Sense: No; Status: None; Manufacturer Part Number: 87832-1420; ComponentHeight: 7.6mm; HelpURL: \\cern.ch\dfs\Applications\Altium\Datasheets\MOLEX_87832-1420.pdf; Author: CERN DEM JLC; CreateDate: 09.09.2008; LatestRevisionDate: 09.09.2008
L4 L5 L13 L15 L18 L26 = IND0603_MURATA_BLM18SG121TN1D: Inductor; Part Description: SMD EMIFIL Suppression Chip Ferrite Bead; Manufacturer: MURATA; Power: 3A; Resistance: 0.025R; Tolerance: ±25%; Part Number: IND0603_MURATA_BLM18SG121TN1D; Component Kind: Standard; Component Type: Standard; Pin Count: 2; Value: 120R@100MHz; Status: None; Manufacturer Part Number: BLM18SG121TN1D; Case: 0603; Mounted: Yes; Socket: No; SMD: Yes; Sense: No; ComponentHeight: 0.65mm; HelpURL: \\cern.ch\dfs\Applications\Altium\Datasheets\IND0603_MURATA_BLM18S.pdf; Author: CERN DEM JLC; CreateDate: 23.07.2014; LatestRevisionDate: 23.07.2014
  L4 L5: ClassName: Artix
LD3 = LED_KINGBRIGHT_KPH-1608CGCK: LED Green 1C 2A; Part Description: SMD Green LED, Case 1.6mmX0.8mm(0603), 0.65mm Thickness; PressFit: No; Bonding: No; Manufacturer Part Number: KPH-1608CGCK; ComponentHeight: 0.65mm; HelpURL: \\cern.ch\dfs\Applications\Altium\Datasheets\LED_KINGBRIGHT_KPH-1608CGCK.pdf; Part Number: LED_KINGBRIGHT_KPH-1608CGCK; Component Kind: Standard; Component Type: Standard; Color: Green; PackageDescription: SMT Green LED, Case 0603, Body L 1.6 x W 0.8mm H 0.65mm; Manufacturer: KINGBRIGHT; Pin Count: 2; Mounted: Yes; Socket: No; SMD: Yes; Sense: No; Author: CERN DEM JLC; CreateDate: 03.07.2017; LatestRevisionDate: 03.07.2017
R48 R89 R91 R238 R239 = R0402_0R_JUMPER: Resistor; Part Description: 1A (0.05R Max DC Resistance) Zero Ohm Jumper; Manufacturer: GENERIC; Manufacturer1 Part Number: 232270591001L; PressFit: No; Part Number: R0402_0R_JUMPER; Component Kind: Standard; Component Type: Standard; Pin Count: 2; Value: 0; Status: Not Recommended; Manufacturer Part Number: R0402_0R_JUMPER; Case: 0402; Mounted: Yes; Sense: No; Socket: No; SMD: Yes; Manufacturer1 Example: YAGEO PHYCOMP; Manufacturer1 ComponentHeight: 0.4mm; HelpURL: \\cern.ch\dfs\Applications\Altium\Datasheets\R0402_Phycomp_RC0402.pdf; Author: CERN DEM JLC; CreateDate: 03.12.2007; LatestRevisionDate: 17.10.2012; ClassName: Artix
R57 = R0402_300R_1%_0.0625W_100PPM: Resistor - 1%; Part Description: General Purpose Thick Film Chip Resistor; Manufacturer: GENERIC; Manufacturer1 Part Number: 232270673001L; TC: ±100ppm/°C; PressFit: No; Part Number: R0402_300R_1%_0.0625W_100PPM; Component Kind: Standard; Component Type: Standard; Pin Count: 2; Value: 300; Status: Not Recommended; Power: 0.0625W; Tolerance: ±1%; Manufacturer Part Number: R0402_300R_1%_0.0625W_100PPM; Case: 0402; Mounted: Yes; Sense: No; Socket: No; SMD: Yes; Manufacturer1 Example: YAGEO PHYCOMP; Manufacturer1 ComponentHeight: 0.4mm; HelpURL: \\cern.ch\dfs\Applications\Altium\Datasheets\R0402_Phycomp_RC0402.pdf; Author: CERN DEM JLC; CreateDate: 03.12.2007; LatestRevisionDate: 17.10.2012
R59 R80 = R0402_0R_JUMPER: Resistor; Manufacturer: GENERIC; Part Description: 1A (0.05R Max DC Resistance) Zero Ohm Jumper; Manufacturer1 Part Number: 232270591001L; PressFit: No; Manufacturer Part Number: R0402_0R_JUMPER; Part Number: R0402_0R_JUMPER; Value: 0; Component Kind: Standard; Component Type: Standard; Pin Count: 2; Status: Not Recommended; Case: 0402; Mounted: Yes; Sense: No; Socket: No; SMD: Yes; Manufacturer1 Example: YAGEO PHYCOMP; Manufacturer1 ComponentHeight: 0.4mm; HelpURL: \\cern.ch\dfs\Applications\Altium\Datasheets\R0402_Phycomp_RC0402.pdf; Author: CERN DEM JLC; CreateDate: 03.12.2007; LatestRevisionDate: 17.10.2012
R63 = R0402_10K_1%_0.0625W_100PPM: Resistor - 1%; Manufacturer: GENERIC; Part Description: General Purpose Thick Film Chip Resistor; Manufacturer1 Part Number: 232270671003L; TC: ±100ppm/°C; PressFit: No; Manufacturer Part Number: R0402_10K_1%_0.0625W_100PPM; Part Number: R0402_10K_1%_0.0625W_100PPM; Tolerance: ±1%; Value: 10k; Component Kind: Standard; Component Type: Standard; Pin Count: 2; Status: Not Recommended; Power: 0.0625W; Case: 0402; Mounted: Yes; Sense: No; Socket: No; SMD: Yes; Manufacturer1 Example: YAGEO PHYCOMP; Manufacturer1 ComponentHeight: 0.4mm; HelpURL: \\cern.ch\dfs\Applications\Altium\Datasheets\R0402_Phycomp_RC0402.pdf; Author: CERN DEM JLC; CreateDate: 03.12.2007; LatestRevisionDate: 17.10.2012
R67 R93 R233 = R0402_1K_1%_0.0625W_100PPM: Resistor - 1%; Part Description: General Purpose Thick Film Chip Resistor; Manufacturer: GENERIC; Manufacturer1 Part Number: 232270671002L; TC: ±100ppm/°C; PressFit: No; Part Number: R0402_1K_1%_0.0625W_100PPM; Component Kind: Standard; Component Type: Standard; Pin Count: 2; Value: 1k; Status: Not Recommended; Power: 0.0625W; Tolerance: ±1%; Manufacturer Part Number: R0402_1K_1%_0.0625W_100PPM; Case: 0402; Mounted: Yes; Sense: No; Socket: No; SMD: Yes; Manufacturer1 Example: YAGEO PHYCOMP; Manufacturer1 ComponentHeight: 0.4mm; HelpURL: \\cern.ch\dfs\Applications\Altium\Datasheets\R0402_Phycomp_RC0402.pdf; Author: CERN DEM JLC
  R67: CreateDate: 2007-12-03; LatestRevisionDate: 2012-10-17
  R93 R233: CreateDate: 03.12.2007; LatestRevisionDate: 17.10.2012; ClassName: Artix
R74 R76 R78 R81 = R0402_22R_1%_0.0625W_100PPM: Resistor - 1%; Part Description: General Purpose Thick Film Chip Resistor; Manufacturer: GENERIC; Manufacturer1 Part Number: 232270672209L; TC: ±100ppm/°C; PressFit: No; Part Number: R0402_22R_1%_0.0625W_100PPM; Component Kind: Standard; Component Type: Standard; Pin Count: 2; Value: 22; Status: Not Recommended; Power: 0.0625W; Tolerance: ±1%; Manufacturer Part Number: R0402_22R_1%_0.0625W_100PPM; Case: 0402; Mounted: Yes; Sense: No; Socket: No; SMD: Yes; Manufacturer1 Example: YAGEO PHYCOMP; Manufacturer1 ComponentHeight: 0.4mm; HelpURL: \\cern.ch\dfs\Applications\Altium\Datasheets\R0402_Phycomp_RC0402.pdf; Author: CERN DEM JLC; CreateDate: 03-Dec-07; LatestRevisionDate: 17-Oct-12
R79 R84 = R0402_10K_1%_0.0625W_100PPM: Resistor - 1%; Part Description: General Purpose Thick Film Chip Resistor; Manufacturer: GENERIC; Manufacturer1 Part Number: 232270671003L; TC: ±100ppm/°C; PressFit: No; Part Number: R0402_10K_1%_0.0625W_100PPM; Component Kind: Standard; Component Type: Standard; Pin Count: 2; Value: 10k; Status: Not Recommended; Power: 0.0625W; Tolerance: ±1%; Manufacturer Part Number: R0402_10K_1%_0.0625W_100PPM; Case: 0402; Mounted: Yes; Sense: No; Socket: No; SMD: Yes; Manufacturer1 Example: YAGEO PHYCOMP; Manufacturer1 ComponentHeight: 0.4mm; HelpURL: \\cern.ch\dfs\Applications\Altium\Datasheets\R0402_Phycomp_RC0402.pdf; Author: CERN DEM JLC; CreateDate: 2007-12-03; LatestRevisionDate: 2012-10-17
R92 = R0402_1k_1%_0.0625W_100PPM: Resistor - 1%; Part Description: General Purpose Thick Film Chip Resistor; Manufacturer: GENERIC; Manufacturer1 Part Number: 232270671002L; TC: ±100ppm/°C; PressFit: No; Part Number: R0402_1K_1%_0.0625W_100PPM; Component Kind: Standard; Component Type: Standard; Pin Count: 2; Value: 1k; Status: Not Recommended; Power: 0.0625W; Tolerance: ±1%; Manufacturer Part Number: R0402_1K_1%_0.0625W_100PPM; Case: 0402; Mounted: Yes; Sense: No; Socket: No; SMD: Yes; Manufacturer1 Example: YAGEO PHYCOMP; Manufacturer1 ComponentHeight: 0.4mm; HelpURL: \\cern.ch\dfs\Applications\Altium\Datasheets\R0402_Phycomp_RC0402.pdf; Author: CERN DEM JLC; CreateDate: 03.12.2007; LatestRevisionDate: 17.10.2012; ClassName: Artix
T4 = BSS138LT1G: N-CHANNEL MOSFET WITH DIODE; Part Description: 50V 200mA N-Channel Enhancement Mode Field-Effect Transistor; Manufacturer: ON SEMICONDUCTOR; PressFit: No; Bonding: No; Part Number: BSS138LT1G; Component Kind: Standard; Component Type: Standard; Device: BSS138LT1G; PackageDescription: SOT23 3-Leads, Pitch 0.95mm - Body 1.4x3mm, IPC Medium Density; Manufacturer Part Number: BSS138LT1G; Pin Count: 3; Case: SOT23-3; Mounted: Yes; Socket: No; SMD: Yes; Sense: No; ComponentHeight: 1.11mm; HelpURL: \\cern.ch\dfs\Applications\Altium\Datasheets\BSS138LT1G.pdf; Author: CERN DEM JLC; CreateDate: 23.03.2009; LatestRevisionDate: 23.03.2009